# Altium schematic sheet MainCircuit.SchDoc: Controlador PID
size A4; Organization: Altium Limited; Address1: L3, 12a Rodborough Rd; Address2: Frenchs Forest; Address3: NSW; Address4: Australia 2086; Revision: R00; sheetnumberh: 2; sheettotall: 5; Alumno: Irumberry Juan - Matwiejczuk Leandro; Curso: 512; Materia: Técnicas Digitales III; Docentes: Ing. Marín Ariel; SheetNumber: 2; SheetTotal: 5
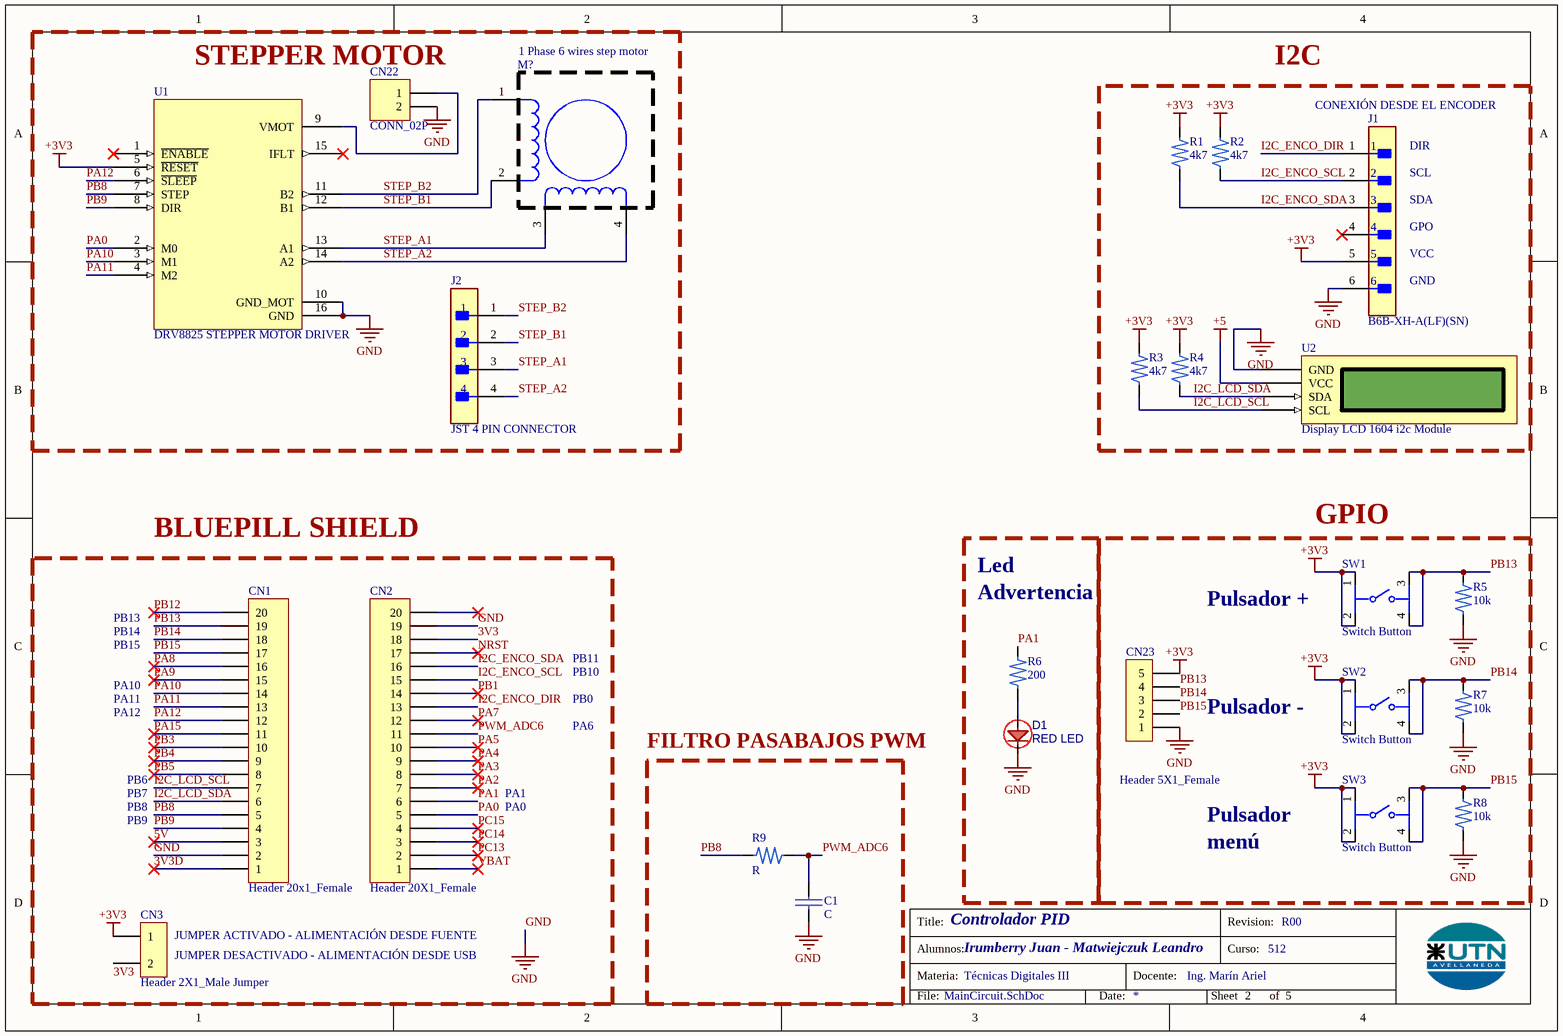
[diagram p0: MainCircuit.SchDoc]

## Parts
C1  C  [CAP_Axial_0.2mm]
CN1  Header 20x1_Female  [SPECIAL P_FEMALE_LEFT_BLUEPILL]
CN2  Header 20X1_Female  [1*20P_FEMALE]
CN3  Header 2X1_Male Jumper  [JUMPER 2x1 PIN]
CN22  CONN_02P  [TERMINAL_BLOCK_2_PIN]
CN23  Header 5X1_Female  [1*5P_FEMALE]
D1  RED LED  [LED_DIODE_3.9mm]
J1  B6B-XH-A(LF)(SN)  [JST 6 PIN CONNECTOR]
J2  JST 4 PIN CONNECTOR  [JST 4 PIN CONNECTOR]
M?  1 Phase 6 wires step motor  (graphical)
R1  4k7  [RES_AXIAL_3.2_6MM]
R2  4k7  [RES_AXIAL_3.2_6MM]
R3  4k7  [RES_AXIAL_3.2_6MM]
R4  4k7  [RES_AXIAL_3.2_6MM]
R5  10k  [RES_AXIAL_3.2_6MM]
R6  200  [RES_AXIAL_3.2_6MM]
R7  10k  [RES_AXIAL_3.2_6MM]
R8  10k  [RES_AXIAL_3.2_6MM]
R9  R  [RES_AXIAL_3.2_6MM]
SW1  Switch Button  [SWITCH]
SW2  Switch Button  [SWITCH]
SW3  Switch Button  [SWITCH]
U1  DRV8825 STEPPER MOTOR DRIVER  [IC_DRV8825_MODULE]
U2  Display LCD 1604 i2c Module  [1*4P_FEMALE]

## Blocks framed on the sheet
STEPPER MOTOR: CN22 J2 M? U1
I2C: J1 R1-R4 U2
BLUEPILL SHIELD: CN1-CN3
GPIO: CN23 R5 R7 R8 SW1-SW3
FILTRO PASABAJOS PWM: C1 R9

## Nets
+3V3: CN3.1 CN23.5 J1.5 R1.2 R2.2 R3.2 R4.2 SW1.1 SW1.2 SW2.1 SW2.2 SW3.1 SW3.2 U1.5(~{RESET})
+5: U2.2(VCC)
GND: C1.2 CN1.2 CN2.19 CN22.2 CN23.1 D1.K J1.6 R5.1 R7.1 R8.1 U1.10(GND_MOT) U1.16(GND) U2.1(GND)
3V3: CN2.18 CN3.2
3V3D: CN1.1
5V: CN1.3
I2C_ENCO_DIR: CN2.13 J1.1
I2C_ENCO_SCL: CN2.15 J1.2 R2.1
I2C_ENCO_SDA: CN2.16 J1.3 R1.1
I2C_LCD_SCL: CN1.7 R3.1 U2.4(SCL)
I2C_LCD_SDA: CN1.6 R4.1 U2.3(SDA)
NRST: CN2.17
PA0: CN2.5 U1.2(M0)
PA1: CN2.6 R6.2
PA2: CN2.7
PA3: CN2.8
PA4: CN2.9
PA5: CN2.10
PA7: CN2.12
PA8: CN1.16
PA9: CN1.15
PA10: CN1.14 U1.3(M1)
PA11: CN1.13 U1.4(M2)
PA12: CN1.12 U1.6(~{SLEEP})
PA15: CN1.11
PB1: CN2.14
PB3: CN1.10
PB4: CN1.9
PB5: CN1.8
PB8: CN1.5 R9.1 U1.7(STEP)
PB9: CN1.4 U1.8(DIR)
PB12: CN1.20
PB13: CN1.19 CN23.4 R5.2 SW1.3 SW1.4
PB14: CN1.18 CN23.3 R7.2 SW2.3 SW2.4
PB15: CN1.17 CN23.2 R8.2 SW3.3 SW3.4
PC13: CN2.2
PC14: CN2.3
PC15: CN2.4
PWM_ADC6: C1.1 CN2.11 R9.2
STEP_A1: J2.3 M?.3 U1.13(A1)
STEP_A2: J2.4 M?.4 U1.14(A2)
STEP_B1: J2.2 M?.2 U1.12(B1)
STEP_B2: J2.1 M?.1 U1.11(B2)
VBAT: CN2.1
NetCN22_1: CN22.1 U1.9(VMOT)
NetD1_A: D1.A R6.1

Not connected (* = marked no-connect by the designer): CN2 20*; J1 4*; U1 1(~{ENABLE})* 15(IFLT)*

## Notes on the sheet
- (near J1) CONEXIÓN DESDE EL ENCODER
- (near J1) DIR
- (near J1) SCL
- (near J1) SDA
- (near J1) GPO
- (near J1) VCC
- (near J1) GND
- Led
- PB14
- PB15
- PB13
- Advertencia
- (near SW1) Pulsador +
- PA10
- PA11
- PA12
- PB10
- PB11
- PB0
- Pulsador -
- PB6
- PA6
- PB7
- PB8
- PB9
- PA1
- PA0
- Pulsador
- menú
- (near CN3) JUMPER ACTIVADO - ALIMENTACIÓN DESDE FUENTE
- (near CN3) JUMPER DESACTIVADO - ALIMENTACIÓN DESDE USB
- Title:
- Revision:
- Alumnos:
- Materia:
- Docente:
- Curso:
- File:
- Date:
- Sheet
- of

## Library data of the parts
C1 = CAP_NP: Non-Polarized Capacitor
CN1 CN2 = Header 20x1_Female: Header, 16-Pin, Single row,female
CN3 = Jumper 2 Pin: Header, 2-Pin, Single row,male; LatestRevisionDate: 17-Jul-2002; LatestRevisionNote: Re-released for DXP Platform.; Publisher: Altium Limited
CN22 = CONN_02P: Connector Generic 2 Vias
CN23 = Header 5X1_Female: Header, 5-Pin, Single row,female; LatestRevisionDate: 17-Jul-2002; LatestRevisionNote: Re-released for DXP Platform.; Publisher: Altium Limited
D1 = LED
J1 = JST 6 PIN: CONN HEADER VERT 6POS 2.5MM
J2 = JST 4 PIN: CONN HEADER VERT 4POS 2.5MM; Number of Contacts: 4; Contact Resistance: 20mR; Voltage Rating: 250V; Max Current Rating: 3A; Gender: Male; Wire/Cable Gauge: 22AWG; Mated Stacking Heights: 9.8mm; Insulation Resistance: 1GR; Orientation: Straight; Contact Type: Male Pin; Contact Finish - Mating: TIN; Series: XH; Max Voltage Rating (AC): 250V; Lead Pitch: 2.5mm; Contact Shape: Square; Insulation Color: Natural; Termination: Solder; Lead Free: Lead Free; Voltage Rating (AC): 250V; Number of Rows: 1; Flammability Rating: UL94 V-0; Number of Positions: 4; Max Operating Temperature: 85°C; Package Quantity: 500; Mount: Through Hole; REACH SVHC: No SVHC; Connector Type: Header; Insulation Material: Nylon; Fastening Type: Detent; Min Operating Temperature: -25°C; Housing Color: White; Packaging: Bulk; Contact Plating: Tin; Contact Material: Brass; Max Voltage Rating (DC): 250V; Housing Material: Polyamide; Color: Natural; Material: Polyamide; Pitch: 2.5mm; Depth: 5.75mm; Current Rating: 3A; Length: 12.4mm
M? = Stepper Motor: Stepper Motor 1 Phase 6 wires
R1-R9 = RES: Through-hole Resistor
SW1-SW3 = Switch Button: SWITCH TACTILE SPST-NO 0.05A 24V; Manufacturer: TE Connectivity; Manufacturer Part Number: 1-1825910-4; Operating Force: 160gf; Contact Current Rating: 50mA; Electromechanical Life: 100000Cycles; Contact Resistance: 100mΩ; Octopart: https://octopart.com/1-1825910-4-te+connectivity-42270468; ComponentLink2URL: https://www.te.com/commerce/DocumentDelivery/DDEController?Action=showdoc&DocId=Customer+Drawing%7F1825910%7FC10%7Fpdf%7FEnglish%7FENG_CD_1825910_C10.pdf%7F1-1825910-4; Throw Configuration: SPST-NO; Height: 9.8mm; Package: 1-1825910-4; Automotive: No; Device Class L2: Switches; Voltage Rating Dc: 24V; Temperature Range High: +85°C; Device Class L3: Tactile Switches; Mouser Description: Tactile Switches 6MM ACTHIGH TEMP TACT SWITCH; Lead Free: Yes; Temperature Range Low: -35°C; Digikey Description: SWITCH TACTILE SPST-NO 0.05A 24V; Device Class L1: Electromechanical; Mount: Through Hole; RoHS: TRUE; ComponentLink2Description: Datasheet; Temperature: -35°C to +85°C; Category: Switch
U1 = DRV8825 Module: DRV8825 STEPPER MOTOR DRIVER ,Stepper, Bipolar 8.2 ~ 45VDC Supply 1.5A 8.2 ~ 45V Load